# EAGLE design colororgan (EAGLE 7.2.0)
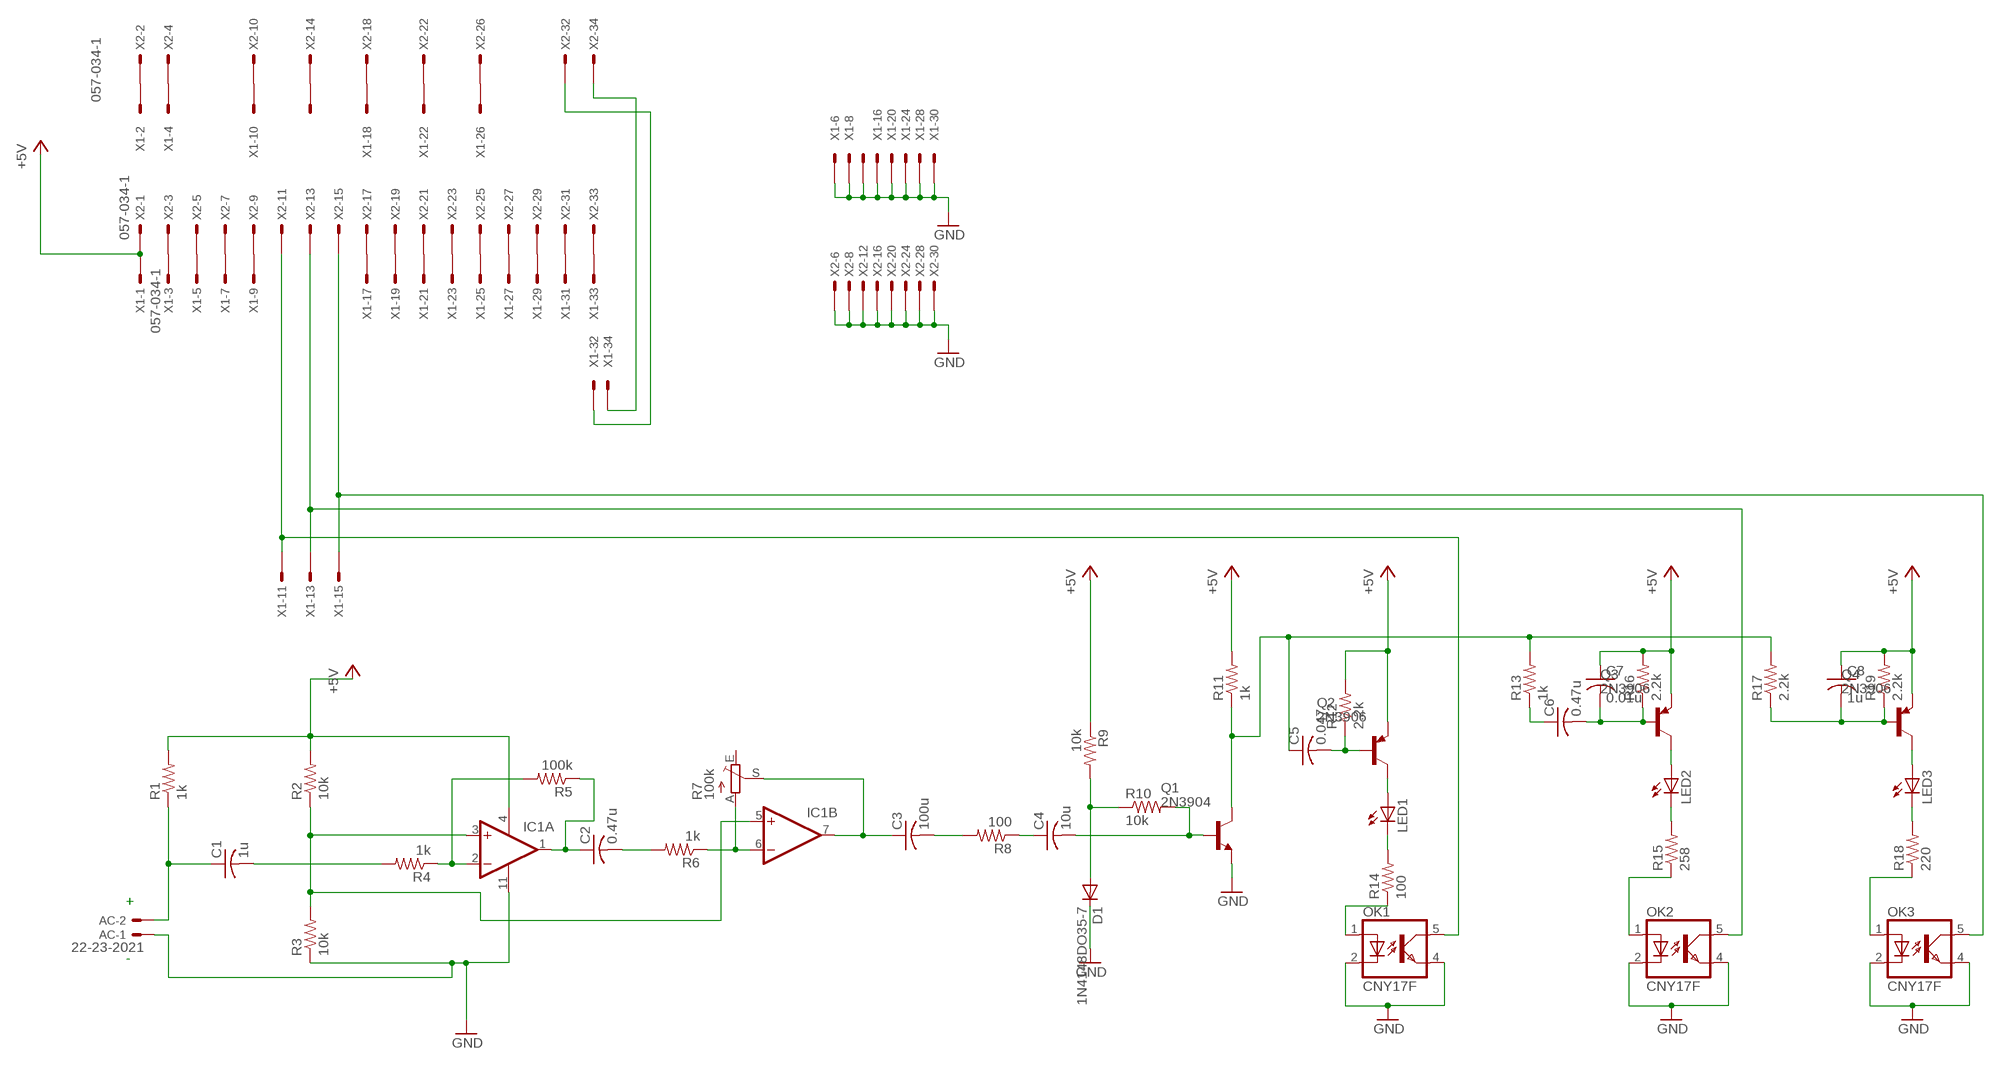
[diagram p0: schematic, sheet 1]

## Parts
AC  22-23-2021  [22-23-2021]
C1  1u  C-US025-050X050  [C025-050X050]
C2  0.47u  C-US025-050X050  [C025-050X050]
C3  100u  C-US025-050X050  [C025-050X050]
C4  10u  C-US025-050X050  [C025-050X050]
C5  0.047  C-US025-050X050  [C025-050X050]
C6  0.47u  C-US025-050X050  [C025-050X050]
C7  0.01u  C-US025-050X050  [C025-050X050]
C8  1u  C-US025-050X050  [C025-050X050]
D1  1N4148DO35-7  [DO35-7]
IC1  LMV324THR  [DIL14]
LED1  LED3MM  [LED3MM]
LED2  LED3MM  [LED3MM]
LED3  LED3MM  [LED3MM]
OK1  CNY17F  [DIL06]
OK2  CNY17F  [DIL06]
OK3  CNY17F  [DIL06]
Q1  2N3904  [TO92]
Q2  2N3906  [TO92]
Q3  2N3906  [TO92]
Q4  2N3906  [TO92]
R1  1k  R-US_0207/10  [0207/10]
R2  10k  R-US_0207/10  [0207/10]
R3  10k  R-US_0207/10  [0207/10]
R4  1k  R-US_0207/10  [0207/10]
R5  100k  R-US_0207/10  [0207/10]
R6  1k  R-US_0207/10  [0207/10]
R7  100k  TRIM_EU-RS3  [RS3]
R8  100  R-US_0207/10  [0207/10]
R9  10k  R-US_0207/10  [0207/10]
R10  10k  R-US_0207/10  [0207/10]
R11  1k  R-US_0207/10  [0207/10]
R12  2.2k  R-US_0207/10  [0207/10]
R13  1k  R-US_0207/10  [0207/10]
R14  100  R-US_0207/10  [0207/10]
R15  258  R-US_0207/10  [0207/10]
R16  2.2k  R-US_0207/10  [0207/10]
R17  2.2k  R-US_0207/10  [0207/10]
R18  220  R-US_0207/10  [0207/10]
R19  2.2k  R-US_0207/10  [0207/10]
X1  057-034-1  [057-034-1]
X2  057-034-1  [057-034-1]

## Nets
+5V [power]: C7.1 C8.1 IC1.4(P:V+) Q2.3(E) Q3.3(E) Q4.3(E) R1.2 R2.2 R9.1 R11.2 R12.2 R16.2 R19.2 X1.1 X2.1
GND [power]: AC.1 D1.C IC1.11(P:V-) OK1.2(C) OK1.4(EMIT) OK2.2(C) OK2.4(EMIT) OK3.2(C) OK3.4(EMIT) Q1.3(E) R3.1 X1.6 X1.8 X1.12 X1.16 X1.20 X1.24 X1.28 X1.30 X2.6 X2.8 X2.12 X2.16 X2.20 X2.24 X2.28 X2.30
N$1: AC.2 C1.1 R1.1
N$2: D1.A R9.2 R10.1
N$3: C1.2 R4.2
N$4: IC1.3(A:+IN) IC1.5(B:+IN) R2.1 R3.2
N$5: IC1.2(A:-IN) R4.1 R5.2
N$6: C2.1 IC1.1(A:OUT) R5.1
N$7: C2.2 R6.2
N$8: IC1.6(B:-IN) R6.1 R7.A
N$9: C4.2 Q1.2(B) R10.2
N$10: C3.1 IC1.7(B:OUT) R7.S
N$11: C3.2 R8.2
N$12: C4.1 R8.1
N$13: C5.1 Q1.1(C) R11.1 R13.2 R17.2
N$14: C5.2 Q2.2(B) R12.1
N$15: OK1.1(A) R14.1
N$16: LED1.K(C) R14.2
N$17: LED1.A Q2.1(C)
N$18: C6.1 R13.1
N$19: C6.2 C7.2 Q3.2(B) R16.1
N$20: OK1.5(COL) X1.11 X2.11
N$21: LED2.A Q3.1(C)
N$22: LED2.K(C) R15.2
N$23: OK2.1(A) R15.1
N$24: OK2.5(COL) X1.13 X2.13
N$25: C8.2 Q4.2(B) R17.1 R19.1
N$26: LED3.A Q4.1(C)
N$27: LED3.K(C) R18.2
N$28: OK3.1(A) R18.1
N$29: OK3.5(COL) X1.15 X2.15
N$30: X1.34 X2.34
N$31: X1.32 X2.32
N$32: X1.2 X2.2
N$35: X1.4 X2.4
N$36: X1.10 X2.10
N$37: X1.14 X2.14
N$38: X1.33 X2.33
N$39: X1.3 X2.3
N$40: X1.5 X2.5
N$41: X1.7 X2.7
N$42: X1.9 X2.9
N$43: X1.17 X2.17
N$44: X1.19 X2.19
N$45: X1.21 X2.21
N$46: X1.23 X2.23
N$47: X1.25 X2.25
N$48: X1.27 X2.27
N$49: X1.29 X2.29
N$50: X1.31 X2.31
N$51: X1.18 X2.18
N$52: X1.22 X2.22
N$53: X1.26 X2.26
Unconnected: IC1.8(C:OUT) IC1.9(C:-IN) IC1.10(C:+IN) IC1.12(D:+IN) IC1.13(D:-IN) IC1.14(D:OUT) R7.E

## Notes on the sheet
- +
- -

## Library data of the parts
AC = con-molex:22-23-2021: .100" (2.54mm) Center Header - 2 Pin; MF: MOLEX; MPN: 22-23-2021; OC_FARNELL: 1462926; OC_NEWARK: 25C3832
C1-C8 = resistor:C-US: CAPACITOR, American symbol
D1 = diode:1N4148: DIODE high speed (Philips)
IC1 = linear:LMV324?*: Quad General Purpose, Low Voltage, Rail-to-Rail Output Operational Amplifiers Source: http://www.national.com/mpf/LM/LMV321.html http://www.national.com/dt/lmv_qual.pdf
LED1-LED3 = led:LED: LED OSRAM: - CHIPLED LG R971, LG N971, LY N971, LG Q971, LY Q971, LO R971, LY R971 LH N974, LH R974 LS Q976, LO Q976, LY Q976 LO Q996 - Hyper CHIPLED LW Q18S LB Q993, LB Q99A, LB R99A - SideLED LS A670, LO A670, LY A670, LG A670, LP A670 LB A673, LV A673, LT A673, LW A673 LH A674 LY A675 LS A676, LA A676, LO A676, LY A676, LW A676 LS A679, LY A679, LG A679 - Hyper Micro SIDELED® LS Y876, LA Y876, LO Y876, LY Y876 LT Y87S - SmartLED LW L88C, LW L88S LB L89C, LB L89S, LG L890 LS L89K, LO L89K, LY L89K LS L896, LA L896, LO L896, LY L896 - TOPLED LS T670, LO T670, LY T670, LG T670, LP T670 LSG T670, LSP T670, LSY T670, LOP T670, LYG T670 LG T671, LOG T671, LSG T671 LB T673, LV T673, LT T673, LW T673 LH T674 LS T676, LA T676, LO T676, LY T676, LB T676, LH T676, LSB T676, LW T676 LB T67C, LV T67C, LT T67C, LS T67K, LO T67K, LY T67K, LW E67C LS E67B, LA E67B, LO E67B, LY E67B, LB E67C, LV E67C, LT E67C LW T67C LS T679, LY T679, LG T679 LS T770, LO T770, LY T770, LG T770, LP T770 LB T773, LV T773, LT T773, LW T773 LH T774 LS E675, LA E675, LY E675, LS T675 LS T776, LA T776, LO T776, LY T776, LB T776 LHGB T686 LT T68C, LB T68C - Hyper Mini TOPLED® LB M676 - Mini TOPLED Santana® LG M470 LS M47K, LO M47K, LY M47K Source: http://www.osram.convergy.de LUXEON: - LUMILED® LXK2-PW12-R00, LXK2-PW12-S00, LXK2-PW14-U00, LXK2-PW14-V00 LXK2-PM12-R00, LXK2-PM12-S00, LXK2-PM14-U00 LXK2-PE12-Q00, LXK2-PE12-R00, LXK2-PE12-S00, LXK2-PE14-T00, LXK2-PE14-U00 LXK2-PB12-K00, LXK2-PB12-L00, LXK2-PB12-M00, LXK2-PB14-N00, LXK2-PB14-P00, LXK2-PB14-Q00 LXK2-PR12-L00, LXK2-PR12-M00, LXK2-PR14-Q00, LXK2-PR14-R00 LXK2-PD12-Q00, LXK2-PD12-R00, LXK2-PD12-S00 LXK2-PH12-R00, LXK2-PH12-S00 LXK2-PL12-P00, LXK2-PL12-Q00, LXK2-PL12-R00 Source: www.luxeon.com KINGBRIGHT: KA-3528ASYC Source: www.kingbright.com
OK1-OK3 = optocoupler:CNY17F: SIEMENS OPTO COUPLER; MF: VISHAY/TELEFUNKEN; MPN: CNY17F-3; OC_FARNELL: 1469473; OC_NEWARK: 58K0172
Q1 = transistor-npn:2N3904: NPN Transistor
Q2-Q4 = transistor-pnp:2N3906: PNP Transistor
R1-R6 R8-R19 = resistor:R-US_: RESISTOR, American symbol
R7 = pot:TRIM_EU-: POTENTIOMETER
X1 X2 = con-panduit:057-034-: CONNECTOR 34-pin series 057 contact pc board low profile headers; OC_FARNELL: unknown; OC_NEWARK: unknown

## Net classes
0 default: width 0.406 mm
1 power: width 0.61 mm

## Board
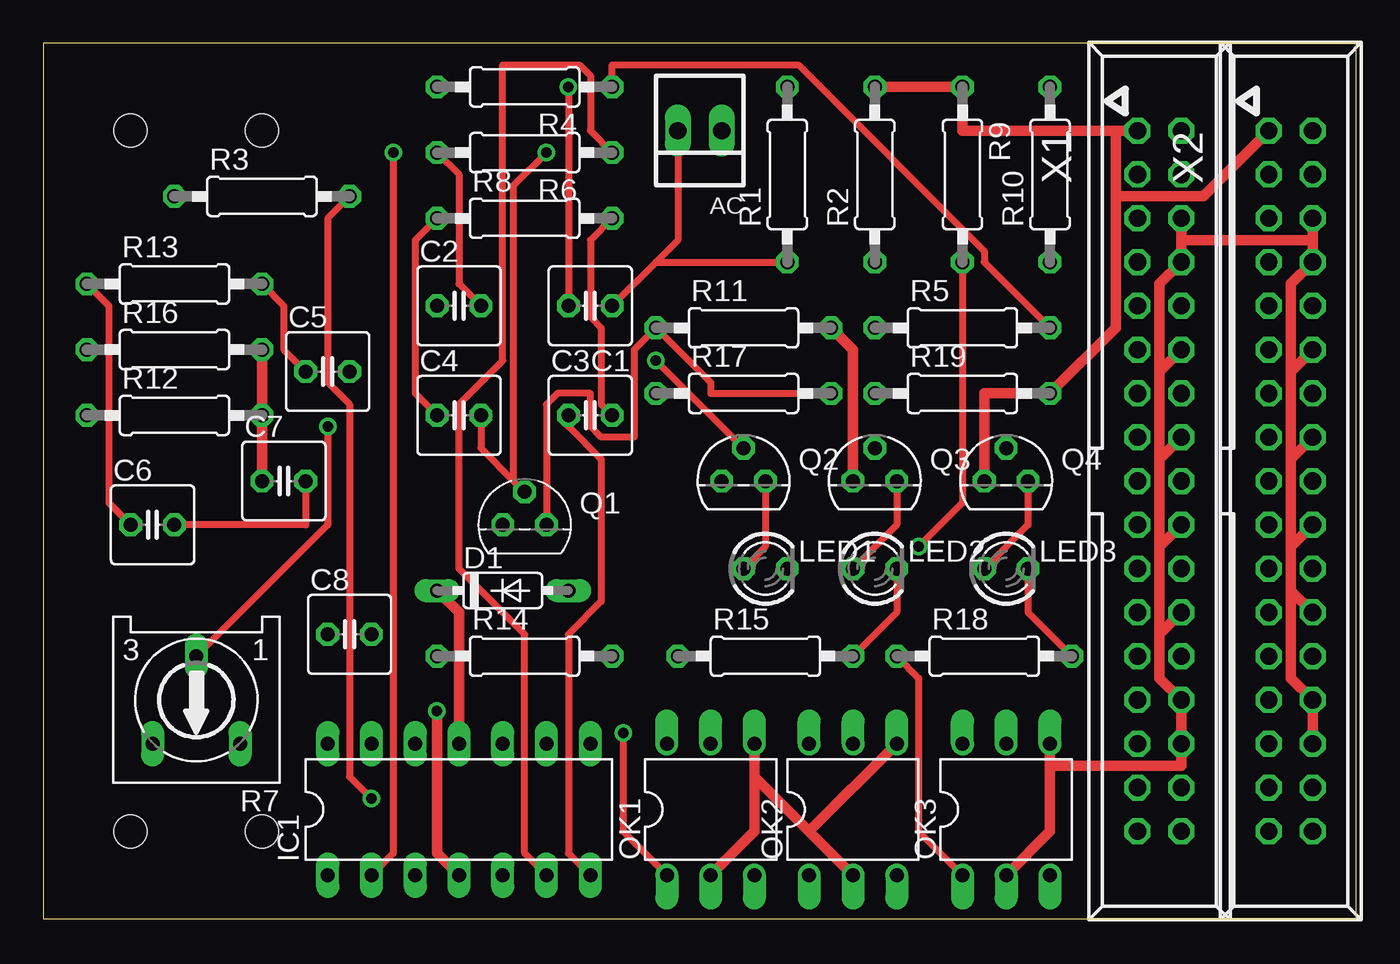
[diagram p1: board, top side]
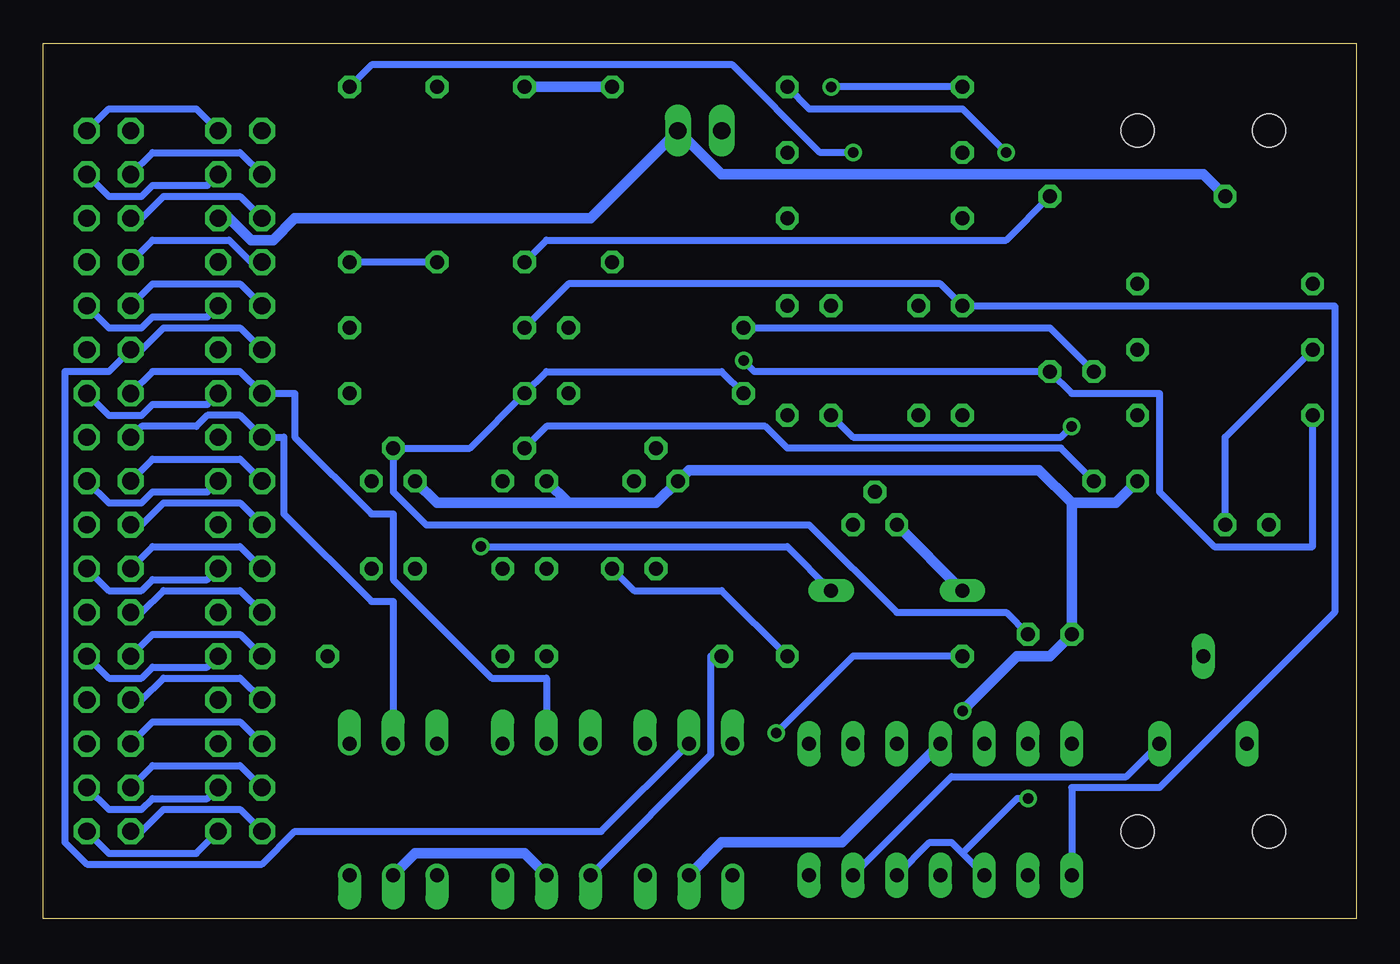
[diagram p2: board, bottom side, seen from below]

Size 76.2 x 50.8 mm. Coordinates in mm from the lower left corner, seen from the top.
Outline: 0,0 76.2,0 76.2,50.8 0,50.8 0,0
Copper layers (1*16): Top 0.035mm / dielectric 1.5mm / Bottom 0.035mm
Design rules "default": minimum track width 10mil, minimum drill 24mil, track to track 8mil, track to pad 8mil, pad to pad 8mil, via to via 8mil, smd to smd 8mil, copper to edge 40mil, drill to drill 8mil, minimum pad ring 10mil, minimum via ring 8mil, stop-mask expansion 4mil, vias tented up to drill 0mil, thermal gap 10mil
Holes 1.91 mm at 5.08,5.08 5.08,45.72 12.7,45.72 12.7,5.08

### Footprints (pad centres in the part's own frame; a part is rotated, then mirrored left to right if it is on the bottom)
22-23-2021 = drill 1 long: 1 -1.27,0; 2 1.27,0
C025-050X050 = drill 0.813 octagon: 1 -1.27,0; 2 1.27,0
DO35-7 = drill 0.813 long: A 3.81,0; C -3.81,0
DIL14 = drill 0.813 long: 1 -7.62,-3.81; 2 -5.08,-3.81; 3 -2.54,-3.81; 4 0,-3.81; 5 2.54,-3.81; 6 5.08,-3.81; 7 7.62,-3.81; 8 7.62,3.81; 9 5.08,3.81; 10 2.54,3.81; 11 0,3.81; 12 -2.54,3.81; 13 -5.08,3.81; 14 -7.62,3.81
LED3MM = drill 0.813 octagon: A -1.27,0; K 1.27,0
DIL06 = drill 0.813 offset: 1 -2.54,-3.81; 2 0,-3.81; 3 2.54,-3.81; 4 2.54,3.81; 5 0,3.81; 6 -2.54,3.81
TO92 = drill 0.813 octagon: 1 1.27,0; 2 0,1.905; 3 -1.27,0
0207/10 = drill 0.813 octagon: 1 -5.08,0; 2 5.08,0
RS3 = drill 0.813 long: A -2.54,2.54; E 2.54,2.54; S 0,-2.54
057-034-1 = drill 1 octagon: 1 -20.32,-1.27; 2 -20.32,1.27; 3 -17.78,-1.27; 4 -17.78,1.27; 5 -15.24,-1.27; 6 -15.24,1.27; 7 -12.7,-1.27; 8 -12.7,1.27; 9 -10.16,-1.27; 10 -10.16,1.27; 11 -7.62,-1.27; 12 -7.62,1.27; 13 -5.08,-1.27; 14 -5.08,1.27; 15 -2.54,-1.27; 16 -2.54,1.27; 17 0,-1.27; 18 0,1.27; 19 2.54,-1.27; 20 2.54,1.27; 21 5.08,-1.27; 22 5.08,1.27; 23 7.62,-1.27; 24 7.62,1.27; 25 10.16,-1.27; 26 10.16,1.27; 27 12.7,-1.27; 28 12.7,1.27; 29 15.24,-1.27; 30 15.24,1.27; 31 17.78,-1.27; 32 17.78,1.27; 33 20.32,-1.27; 34 20.32,1.27

### Placement (x,y rotation side)
AC  38.1,45.72 180 top
C1  31.75,35.56 180 top
C2  24.13,35.56 0 top
C3  31.75,29.21 0 top
C4  24.13,29.21 0 top
C5  16.51,31.75 0 top
C6  6.35,22.86 0 top
C7  13.97,25.4 0 top
C8  17.78,16.51 0 top
D1  26.67,19.05 0 top
IC1  24.13,6.35 0 top
LED1  41.91,20.32 0 top
LED2  48.26,20.32 0 top
LED3  55.88,20.32 0 top
OK1  38.73,6.35 0 top
OK2  46.99,6.35 0 top
OK3  55.88,6.35 0 top
Q1  27.94,22.86 0 top
Q2  40.64,25.4 0 top
Q3  48.26,25.4 0 top
Q4  55.88,25.4 0 top
R1  43.18,43.18 90 top
R2  48.26,43.18 90 top
R3  12.7,41.91 0 top
R4  27.94,48.26 180 top
R5  53.34,34.29 0 top
R6  27.94,44.45 180 top
R7  8.89,12.7 180 top
R8  27.94,40.64 0 top
R9  53.34,43.18 270 top
R10  58.42,43.18 90 top
R11  40.64,34.29 0 top
R12  7.62,29.21 0 top
R13  7.62,36.83 0 top
R14  27.94,15.24 0 top
R15  41.91,15.24 0 top
R16  7.62,33.02 0 top
R17  40.64,30.48 0 top
R18  54.61,15.24 0 top
R19  53.34,30.48 0 top
X1  64.77,25.4 270 top
X2  72.39,25.4 270 top

### Tracks (layer width: path | path; a pad name or v marks a point on that pad's centre or on a via)
+5V  (via drill 0.61)
  Top 0.61: C7.1 R12.2 R16.2 | IC1.4 22.86,3.81 v22.86,12.06 | R11.2 46.99,33.02 Q3.3 | Q4.3 54.61,30.48 R19.2 62.23,34.29 62.23,41.91 | R2.2 R9.1 53.34,45.72 62.23,45.72 | 62.23,45.72 X1.1 | X2.1 67.31,41.91 62.23,41.91 | 62.23,45.72 62.23,41.91
  Bottom 0.61: 16.51,24.13 C8.1 17.78,15.24 19.68,15.24 v22.86,12.06 | 16.51,24.13 13.97,24.13 C7.1 | 45.72,24.13 40.64,24.13 Q2.3 38.73,26.04 18.41,26.04 16.51,24.13 | Q3.3 45.72,24.13 | Q4.3 53.34,24.13 45.72,24.13 | R2.2 R1.2
GND
  Top 0.61: IC1.11 24.13,17.78 D1.C | OK1.2 41.27,5.08 41.27,8.26 | OK1.4 41.27,8.26 | 41.27,8.26 44.45,5.08 | 44.45,5.08 OK2.2 | 44.45,5.08 OK2.4 | X2.6 73.66,39.37 | 73.66,39.37 X2.8 72.39,36.83 72.39,31.75 | X2.30 X2.28 72.39,13.97 72.39,19.05 | 72.39,19.05 X2.24 | 72.39,21.59 72.39,19.05 | X2.20 72.39,21.59 | 72.39,26.67 X2.16 | 72.39,21.59 72.39,26.67 | 72.39,31.75 X2.12 | 72.39,26.67 72.39,31.75 | OK3.2 58.42,5.08 58.42,8.89 | OK3.4 58.42,8.89 | X1.6 66.04,39.37 | 66.04,39.37 X1.8 64.77,36.83 64.77,31.75 | 64.77,16.51 X1.24 | 64.77,16.51 64.77,13.97 X1.28 X1.30 66.04,8.89 58.42,8.89 | 64.77,21.59 X1.20 | 64.77,16.51 64.77,21.59 | 64.77,26.67 X1.16 | 64.77,21.59 64.77,26.67 | 64.77,31.75 X1.12 | 64.77,26.67 64.77,31.75 | 66.04,39.37 73.66,39.37
  Bottom 0.61: D1.C Q1.3 | IC1.11 29.84,4.45 36.83,4.45 OK1.2 | R3.1 8.89,43.18 36.83,43.18 AC.1 44.45,40.64 61.59,40.64 62.87,39.37 64.14,39.37 65.41,40.64 X1.6 | OK2.2 48.26,3.81 54.61,3.81 OK3.2
N$1
  Top 0.406: 35.56,38.1 36.83,39.37 AC.2 | 35.56,38.1 C1.1 | 35.56,38.1 R1.1
N$2  (via drill 0.61)
  Top 0.406: v50.8,21.59 53.34,24.13 R9.2
  Bottom 0.406: D1.A 33.02,21.59 v50.8,21.59 | R9.2 R10.1
N$3  (via drill 0.61)
  Top 0.406: v30.48,48.26 C1.2
  Bottom 0.406: R4.2 v30.48,48.26
N$4  (via drill 0.61)
  Top 0.406: v19.05,6.99 17.78,8.26 17.78,29.84 16.51,31.11 16.51,40.64 R3.2
  Bottom 0.406: 22.86,3.81 23.5,4.45 24.77,4.45 IC1.5 | 22.86,3.81 IC1.3 | R3.2 20.32,39.37 46.99,39.37 R2.1 | 22.86,3.81 19.68,6.99 v19.05,6.99
N$5  (via drill 0.61)
  Top 0.406: IC1.2 20.32,3.81 v20.32,44.45 | R5.2 54.61,38.1 54.61,38.73 43.81,49.53 33.02,49.53 R4.1
  Bottom 0.406: v20.32,44.45 22.86,46.99 31.75,46.99 R4.1
N$6
  Bottom 0.406: IC1.1 16.51,7.62 11.43,7.62 1.27,17.78 1.27,35.56 C2.1 24.13,36.83 45.72,36.83 R5.1
N$7
  Top 0.406: C2.2 24.13,36.83 24.13,43.18 R6.2
N$8
  Top 0.406: R6.1 31.75,45.72 31.75,48.9 31.11,49.53 26.67,49.53 26.67,32.38 24.13,29.84 24.13,20.32 27.94,16.51 27.94,3.81 IC1.6
  Bottom 0.406: R7.A 13.34,8.26 23.5,8.26 IC1.6
N$9  (via drill 0.61)
  Top 0.406: 27.3,25.4 25.4,27.3 C4.2 | 27.3,25.4 Q1.2 | v29.21,44.45 27.3,42.55 27.3,25.4
  Bottom 0.406: R10.2 57.15,49.53 36.2,49.53 31.11,44.45 v29.21,44.45
N$10  (via drill 0.61)
  Top 0.406: R7.S 16.51,22.86 v16.51,28.57 | IC1.7 30.48,3.81 30.48,16.51 32.38,18.41 32.38,26.67 30.48,28.57 C3.1
  Bottom 0.406: v16.51,28.57 17.14,27.94 29.21,27.94 C3.1
N$11
  Top 0.406: C3.2 32.38,29.84 32.38,34.29 31.75,34.92 31.75,39.37 R8.2
N$12
  Top 0.406: C4.1 21.59,30.48 21.59,39.37 R8.1
N$13
  Top 0.406: C5.1 13.97,33.02 13.97,35.56 R13.2 | Q1.1 29.21,29.84 29.84,30.48 31.75,30.48 31.75,28.57 32.38,27.94 34.29,27.94 34.29,33.02 R11.1 38.73,31.11 38.73,30.48 R17.2
  Bottom 0.406: C5.1 17.78,34.29 R11.1
N$14  (via drill 0.61)
  Top 0.406: v35.56,32.38 Q2.2
  Bottom 0.406: R12.1 2.54,21.59 8.26,21.59 11.43,24.77 11.43,30.48 16.51,30.48 C5.2 34.92,31.75 v35.56,32.38
N$15  (via drill 0.61)
  Top 0.406: OK1.1 33.66,5.08 v33.66,10.79
  Bottom 0.406: v33.66,10.79 29.21,15.24 R14.1
N$16
  Bottom 0.406: R14.2 36.83,19.05 41.91,19.05 LED1.K
N$17
  Top 0.406: LED1.A 41.91,21.59 Q2.1
N$18
  Top 0.406: C6.1 3.81,24.13 3.81,35.56 R13.1
N$19
  Top 0.406: C6.2 15.24,22.86 C7.2
  Bottom 0.406: R16.1 7.62,27.94 C6.2 | Q3.2 46.99,28.57 34.29,28.57 33.02,27.3 17.14,27.3 C7.2
N$20
  Bottom 0.406: OK1.5 43.81,5.08 61.59,5.08 63.5,3.17 73.66,3.17 74.93,4.45 74.93,31.75 72.39,31.75 X2.11 70.48,33.02 69.22,34.29 64.77,34.29 X1.11
N$21
  Top 0.406: LED2.A 49.53,22.86 Q3.1
N$22
  Top 0.406: R15.2 49.53,17.78 LED2.K
N$23
  Bottom 0.406: OK2.1 37.47,9.53 37.47,15.24 R15.1
N$24
  Bottom 0.406: OK2.5 46.99,13.97 50.16,13.97 55.88,19.68 55.88,23.5 57.15,23.5 61.59,27.94 61.59,30.48 X1.13 64.77,31.75 69.85,31.75 X2.13
N$25
  Bottom 0.406: R17.1 36.83,31.75 46.99,31.75 R19.1 51.44,27.3 Q4.2 55.88,24.77 53.98,22.86 31.75,22.86 26.67,17.78 20.32,17.78 C8.2
N$26
  Top 0.406: LED3.A 57.15,22.86 Q4.1
N$27
  Top 0.406: R18.2 57.15,17.78 LED3.K
N$28
  Top 0.406: OK3.1 50.8,5.08 50.8,13.97 R18.1
N$29
  Bottom 0.406: OK3.5 55.88,18.41 57.15,18.41 62.23,23.5 62.23,27.94 X1.15 64.77,29.21 66.67,29.21 67.31,28.57 70.48,28.57 X2.15
N$30
  Bottom 0.406: X1.34 67.31,3.81 72.39,3.81 X2.34
N$31
  Bottom 0.406: X1.32 66.67,6.99 69.85,6.99 70.48,6.35 72.39,6.35 X2.32
N$32
  Bottom 0.406: X1.2 67.31,46.99 72.39,46.99 X2.2
N$35
  Bottom 0.406: X1.4 66.67,42.55 69.85,42.55 70.48,41.91 72.39,41.91 X2.4
N$36
  Bottom 0.406: X1.10 66.67,34.92 69.85,34.92 70.48,34.29 72.39,34.29 X2.10
N$37
  Bottom 0.406: X1.14 66.67,29.84 69.85,29.84 70.48,29.21 72.39,29.21 X2.14
N$38
  Bottom 0.406: X1.33 64.77,6.35 69.22,6.35 70.48,5.08 X2.33
N$39
  Bottom 0.406: X1.3 64.77,44.45 69.85,44.45 X2.3
N$40
  Bottom 0.406: X1.5 64.77,41.91 69.22,41.91 70.48,40.64 X2.5
N$41
  Bottom 0.406: X1.7 64.14,38.1 65.41,39.37 69.85,39.37 X2.7
N$42
  Bottom 0.406: X1.9 64.77,36.83 69.85,36.83 X2.9
N$43
  Bottom 0.406: X1.17 64.77,26.67 69.85,26.67 X2.17
N$44
  Bottom 0.406: X1.19 64.77,24.13 69.22,24.13 70.48,22.86 X2.19
N$45
  Bottom 0.406: X1.21 64.77,21.59 69.85,21.59 X2.21
N$46
  Bottom 0.406: X1.23 64.77,19.05 69.22,19.05 70.48,17.78 X2.23
N$47
  Bottom 0.406: X1.25 64.77,16.51 69.85,16.51 X2.25
N$48
  Bottom 0.406: X1.27 64.77,13.97 69.22,13.97 70.48,12.7 X2.27
N$49
  Bottom 0.406: X1.29 64.77,11.43 69.85,11.43 X2.29
N$50
  Bottom 0.406: X1.31 64.77,8.89 69.85,8.89 X2.31
N$51
  Bottom 0.406: X1.18 66.67,24.77 69.85,24.77 70.48,24.13 72.39,24.13 X2.18
N$52
  Bottom 0.406: X1.22 66.67,19.68 69.85,19.68 70.48,19.05 72.39,19.05 X2.22
N$53
  Bottom 0.406: X1.26 66.67,14.61 69.85,14.61 70.48,13.97 72.39,13.97 X2.26